# Altium schematic sheet Back-end_2.SchDoc
size A4
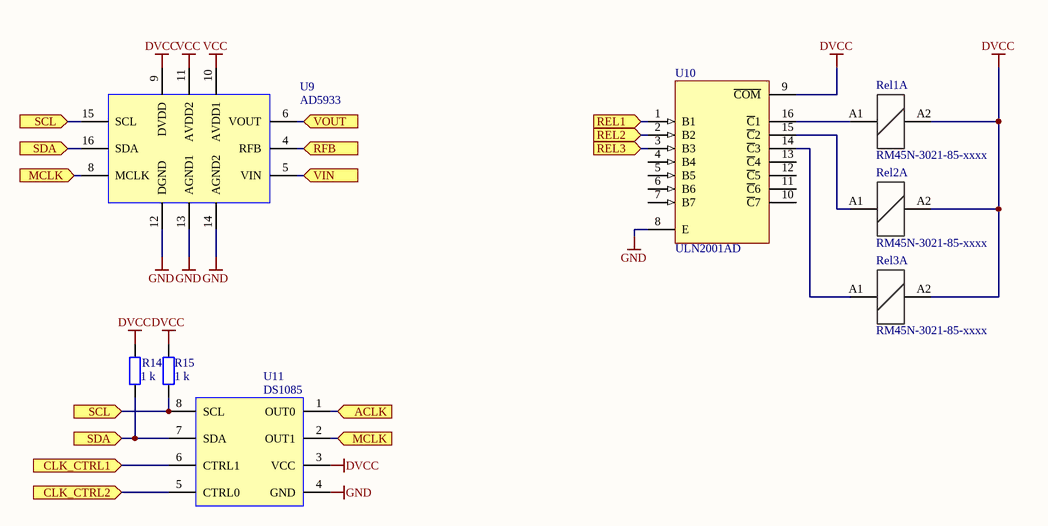
[diagram p0: Back-end_2.SchDoc]

## Parts
R14  1 k  [R1206]
R15  1 k  [R1206]
Rel1  RM45N-3021-85-xxxx  (part A of 2)
Rel2  RM45N-3021-85-xxxx  (part A of 2)
Rel3  RM45N-3021-85-xxxx  (part A of 2)
U9  AD5933
U10  ULN2001AD  [D016_N]
U11  DS1085

## Ports
ACLK, CLK_CTRL1, CLK_CTRL2, MCLK, REL1, REL2, REL3, RFB, SCL, SDA, VIN, VOUT

## Nets
DVCC: R14.2 R15.2 Rel1.A2(COIL) Rel2.A2(COIL) Rel3.A2(COIL) U9.9(DVDD) U10.9(~{COM}) U11.3(VCC)
GND: U9.12(DGND) U9.13(AGND1) U9.14(AGND2) U10.8(E) U11.4(GND)
VCC: U9.10(AVDD1) U9.11(AVDD2)
ACLK: U11.1(OUT0) ; port ACLK
CLK_CTRL1: U11.6(CTRL1) ; port CLK_CTRL1
CLK_CTRL2: U11.5(CTRL0) ; port CLK_CTRL2
MCLK: U9.8(MCLK) U11.2(OUT1) ; port MCLK
REL1: U10.1(B1) ; port REL1
REL2: U10.2(B2) ; port REL2
REL3: U10.3(B3) ; port REL3
RFB: U9.4(RFB) ; port RFB
SCL: R15.1 U9.15(SCL) U11.8(SCL) ; port SCL
SDA: R14.1 U9.16(SDA) U11.7(SDA) ; port SDA
VIN: U9.5(VIN) ; port VIN
VOUT: U9.6(VOUT) ; port VOUT
NetRel1_A1: Rel1.A1(COIL) U10.16(~{C}1)
NetRel2_A1: Rel2.A1(COIL) U10.15(~{C}2)
NetRel3_A1: Rel3.A1(COIL) U10.14(~{C}3)

Not connected (* = marked no-connect by the designer): U10 4(B4) 5(B5) 6(B6) 7(B7) 10(~{C}7) 11(~{C}6) 12(~{C}5) 13(~{C}4)

## Library data of the parts
R14 R15 = Res2: Resistor; Value: 1K; Published: 8-Jun-2000; LatestRevisionDate: 17-Jul-2002; LatestRevisionNote: Re-released for DXP Platform.; PackageReference: AXIAL-0.4; Publisher: Altium Limited; PackageDescription: Axial Device, Thru-Hole; 2 Leads; 0.4 in Pin Spacing
U10 = ULN2001AD: Darlington Transistor Array; ComponentAvailability: Obsolete; Published: 15-May-2002; LatestRevisionDate: 13-Apr-2006; LatestRevisionNote: IPC-7351 Footprint Added.; DatasheetVersion: Sep-1986; PackageVersion: Jan-1998; PackageReference: D016; Publisher: Altium Limited; PackageDescription: 16-Pin Small Outline Integrated Circuit 1.27 mm Pitch; Code_IPC: SOIC127P600-16; ComponentLink1Description: Manufacturer Link; ComponentLink1URL: http://www.ti.com/; ComponentLink2Description: Datasheet; ComponentLink2URL: http://www-s.ti.com/sc/ds/uln2002a.pdf